# Altium schematic sheet dmpro16-pcb-v1-FPGA-Bank15.SchDoc
size A4; DocumentNumber: 6; SheetNumber: 6; SheetTotal: 17; SheetName: FPGA-Bank15
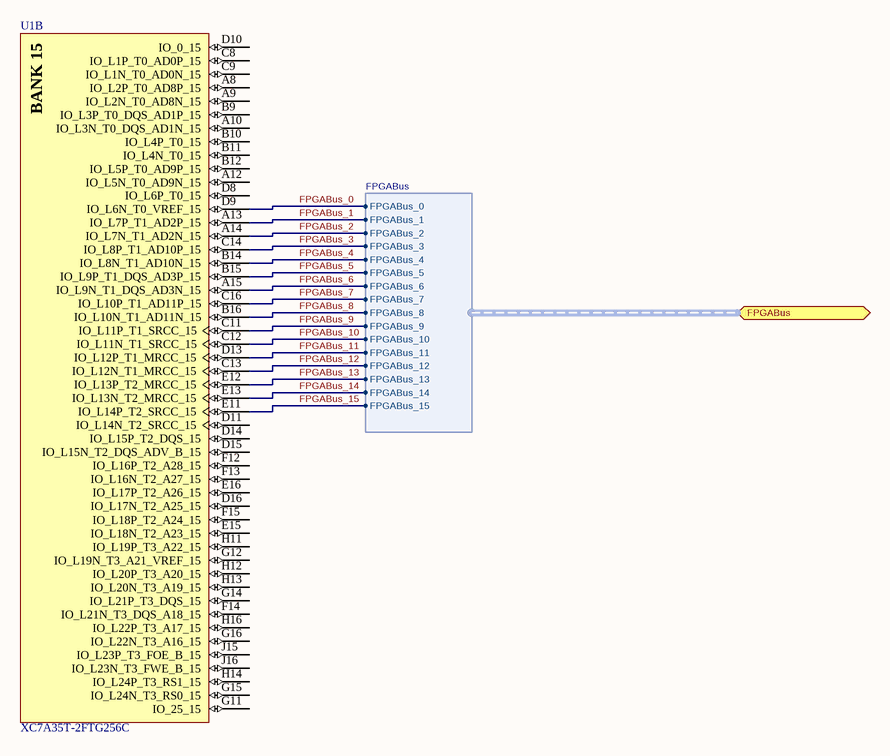
[diagram p0: dmpro16-pcb-v1-FPGA-Bank15.SchDoc]

## Parts
U1  XC7A35T-2FTG256C  [FTG256]  (part B of 8)

## Ports
FPGABus (harness FPGABus)

## Harnesses
FPGABus: FPGABus_0, FPGABus_1, FPGABus_2, FPGABus_3, FPGABus_4, FPGABus_5, FPGABus_6, FPGABus_7, FPGABus_8, FPGABus_9, FPGABus_10, FPGABus_11, FPGABus_12, FPGABus_13, FPGABus_14, FPGABus_15

## Nets
FPGABus_0: U1.D9(IO_L6N_T0_VREF_15) ; port FPGABus.FPGABus_0
FPGABus_1: U1.A13(IO_L7P_T1_AD2P_15) ; port FPGABus.FPGABus_1
FPGABus_2: U1.A14(IO_L7N_T1_AD2N_15) ; port FPGABus.FPGABus_2
FPGABus_3: U1.C14(IO_L8P_T1_AD10P_15) ; port FPGABus.FPGABus_3
FPGABus_4: U1.B14(IO_L8N_T1_AD10N_15) ; port FPGABus.FPGABus_4
FPGABus_5: U1.B15(IO_L9P_T1_DQS_AD3P_15) ; port FPGABus.FPGABus_5
FPGABus_6: U1.A15(IO_L9N_T1_DQS_AD3N_15) ; port FPGABus.FPGABus_6
FPGABus_7: U1.C16(IO_L10P_T1_AD11P_15) ; port FPGABus.FPGABus_7
FPGABus_8: U1.B16(IO_L10N_T1_AD11N_15) ; port FPGABus.FPGABus_8
FPGABus_9: U1.C11(IO_L11P_T1_SRCC_15) ; port FPGABus.FPGABus_9
FPGABus_10: U1.C12(IO_L11N_T1_SRCC_15) ; port FPGABus.FPGABus_10
FPGABus_11: U1.D13(IO_L12P_T1_MRCC_15) ; port FPGABus.FPGABus_11
FPGABus_12: U1.C13(IO_L12N_T1_MRCC_15) ; port FPGABus.FPGABus_12
FPGABus_13: U1.E12(IO_L13P_T2_MRCC_15) ; port FPGABus.FPGABus_13
FPGABus_14: U1.E13(IO_L13N_T2_MRCC_15) ; port FPGABus.FPGABus_14
FPGABus_15: U1.E11(IO_L14P_T2_SRCC_15) ; port FPGABus.FPGABus_15

Not connected (* = marked no-connect by the designer): U1 A8(IO_L2P_T0_AD8P_15) A9(IO_L2N_T0_AD8N_15) A10(IO_L3N_T0_DQS_AD1N_15) A12(IO_L5N_T0_AD9N_15) B9(IO_L3P_T0_DQS_AD1P_15) B10(IO_L4P_T0_15) B11(IO_L4N_T0_15) B12(IO_L5P_T0_AD9P_15) C8(IO_L1P_T0_AD0P_15) C9(IO_L1N_T0_AD0N_15) D8(IO_L6P_T0_15) D10(IO_0_15) D11(IO_L14N_T2_SRCC_15) D14(IO_L15P_T2_DQS_15) D15(IO_L15N_T2_DQS_ADV_B_15) D16(IO_L17N_T2_A25_15) E15(IO_L18N_T2_A23_15) E16(IO_L17P_T2_A26_15) F12(IO_L16P_T2_A28_15) F13(IO_L16N_T2_A27_15) F14(IO_L21N_T3_DQS_A18_15) F15(IO_L18P_T2_A24_15) G11(IO_25_15) G12(IO_L19N_T3_A21_VREF_15) G14(IO_L21P_T3_DQS_15) G15(IO_L24N_T3_RS0_15) G16(IO_L22N_T3_A16_15) H11(IO_L19P_T3_A22_15) H12(IO_L20P_T3_A20_15) H13(IO_L20N_T3_A19_15) H14(IO_L24P_T3_RS1_15) H16(IO_L22P_T3_A17_15) J15(IO_L23P_T3_FOE_B_15) J16(IO_L23N_T3_FWE_B_15)

## Notes on the sheet
- Board:
- Version:
- Sheetname:
- Subject:
- Group:
- Sheet
- of
- Shematic file:
- (in symbol XC7A35T-2FTG256C, part B) BANK 15

## Library data of the parts
U1 = XC7A35T-2FTG256C: Artix-7 FPGA, 170 User I/Os, 0 GTP, 256-Ball BGA, Speed Grade 2, Commercial Grade, Pb-Free; Manufacturer: Xilinx; Total Block RAM: 1800 Kb; GTP: 0; Clock Mgmt Tiles (CMTs): 5; Logic Cells: 33280; Available User I/O: 170; Speed Grades: 2; DatasheetVersion: v1.15; PackageVersion: Rev. 1.11; PackageReference: FTG-256; PackageDescription: 256-Ball Wire-Bond Fine-Pitch Thin BGA, Body 17 x 17 mm, Pitch 1 mm; Maximum Distributed RAM: 400 Kb; Operating Temperature Range: Commercial; NexusDeviceID: XC7A35T-2FTG256C; Mounting Technology: Surface Mount; PartNumber: XC7A35T-2FTG256C; ComponentLink1Description: Manufacturer URL; ComponentLink1URL: http://www.xilinx.com/; ComponentLink2Description: Datasheet; ComponentLink2URL: http://www.xilinx.com/support/documentation/data_sheets/ds180_7Series_Overview.pdf; ComponentLink3Description: Package Specification; ComponentLink3URL: http://www.xilinx.com/support/documentation/user_guides/ug475_7Series_Pkg_Pinout.pdf; ComponentLink4Description: DC and Switching Characteristics; ComponentLink4URL: http://www.xilinx.com/support/documentation/data_sheets/ds181_Artix_7_Data_Sheet.pdf; ComponentLink5Description: Package File; ComponentLink5URL: http://www.xilinx.com/support/packagefiles/a7packages/xc7a200tsbg484pkg.txt; ComponentLink6Description: Packaging and Pinout; ComponentLink6URL: http://www.xilinx.com/support/documentation/user_guides/ug475_7Series_Pkg_Pinout.pdf